# Altium schematic sheet Hardwiring.SchDoc
size 594 x 420 mm; Address1: Address1; Address2: Address2; Address3: Address3; Address4: Address4; DocumentNumber: *Э3; SheetNumber: 10; SheetTotal: 11; DocumentType: Схема электрическая *
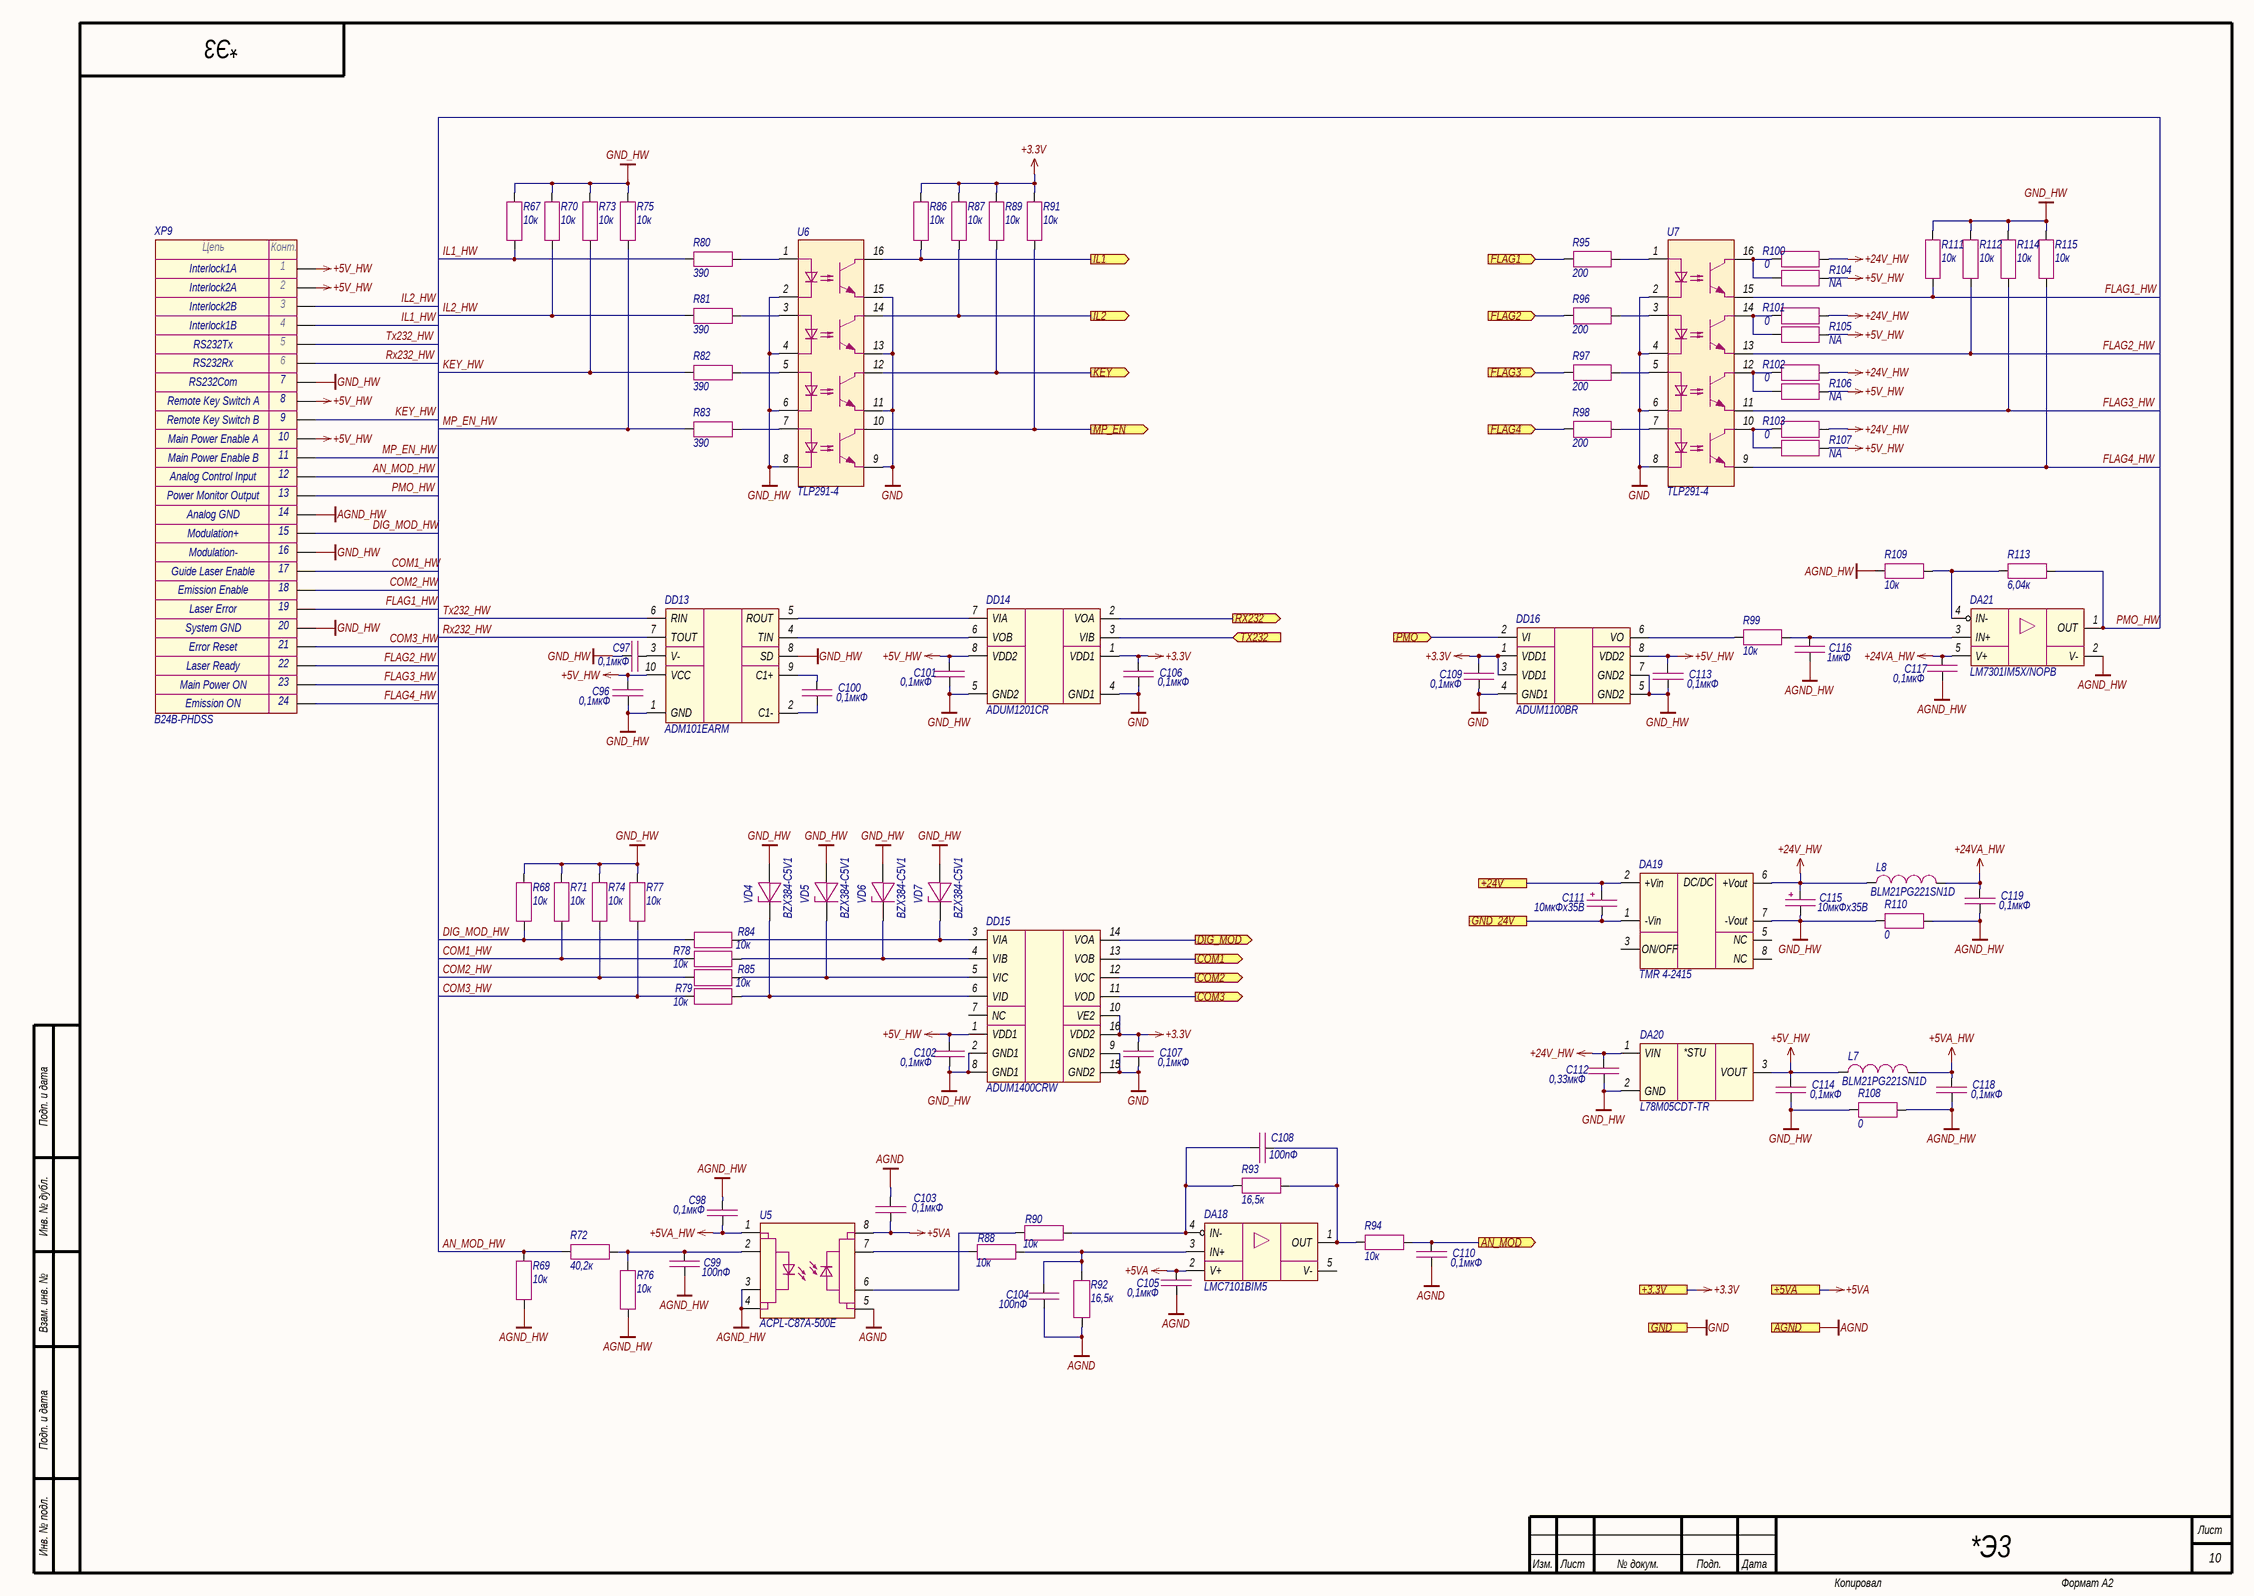
[diagram p0: Hardwiring.SchDoc]

## Parts
C96  0,1мкФ  [CAP_0603]
C97  0,1мкФ  [CAP_0603]
C98  0,1мкФ  [CAP_0603]
C99  100пФ  [CAP_0603]
C100  0,1мкФ  [CAP_0603]
C101  0,1мкФ  [CAP_0603]
C102  0,1мкФ  [CAP_0603]
C103  0,1мкФ  [CAP_0603]
C104  100пФ  [CAP_0603]
C105  0,1мкФ  [CAP_0603]
C106  0,1мкФ  [CAP_0603]
C107  0,1мкФ  [CAP_0603]
C108  100пФ  [CAP_0603]
C109  0,1мкФ  [CAP_0603]
C110  0,1мкФ  [CAP_0603]
C111  10мкФх35B  [CAP_C]
C112  0,33мкФ  [CAP_0805]
C113  0,1мкФ  [CAP_0603]
C114  0,1мкФ  [CAP_0603]
C115  10мкФх35B  [CAP_C]
C116  1мкФ  [CAP_0603]
C117  0,1мкФ  [CAP_0603]
C118  0,1мкФ  [CAP_0603]
C119  0,1мкФ  [CAP_0603]
DA18  LMC7101BIM5  [SOT-23-5]
DA19  TMR 4-2415  [TMR4 (SIP-8)]
DA20  L78M05CDT-TR  [TO-252]
DA21  LM7301IM5X/NOPB  [SOT-23-5]
DD13  ADM101EARM  [MSOP-10]
DD14  ADUM1201CR  [SOIC-8]
DD15  ADUM1400CRW  [SOIC-16W]
DD16  ADUM1100BR  [SOIC-8]
L7  BLM21PG221SN1D  [IND_0805]
L8  BLM21PG221SN1D  [IND_0805]
R67  10к  [RES_0603]
R68  10к  [RES_0603]
R69  10к  [RES_0603]
R70  10к  [RES_0603]
R71  10к  [RES_0603]
R72  40,2к  [RES_0603]
R73  10к  [RES_0603]
R74  10к  [RES_0603]
R75  10к  [RES_0603]
R76  10к  [RES_0603]
R77  10к  [RES_0603]
R78  10к  [RES_0603]
R79  10к  [RES_0603]
R80  390  [RES_0603]
R81  390  [RES_0603]
R82  390  [RES_0603]
R83  390  [RES_0603]
R84  10к  [RES_0603]
R85  10к  [RES_0603]
R86  10к  [RES_0603]
R87  10к  [RES_0603]
R88  10к  [RES_0603]
R89  10к  [RES_0603]
R90  10к  [RES_0603]
R91  10к  [RES_0603]
R92  16,5к  [RES_0603]
R93  16,5к  [RES_0603]
R94  10к  [RES_0603]
R95  200  [RES_0603]
R96  200  [RES_0603]
R97  200  [RES_0603]
R98  200  [RES_0603]
R99  10к  [RES_0603]
R100  0  [RES_0603]
R101  0  [RES_0603]
R102  0  [RES_0603]
R103  0  [RES_0603]
R104  NA  [RES_0603]
R105  NA  [RES_0603]
R106  NA  [RES_0603]
R107  NA  [RES_0603]
R108  0  [RES_0805]
R109  10к  [RES_0603]
R110  0  [RES_0805]
R111  10к  [RES_0603]
R112  10к  [RES_0603]
R113  6,04к  [RES_0603]
R114  10к  [RES_0603]
R115  10к  [RES_0603]
U5  ACPL-C87A-500E  [SSO-8]
U6  TLP291-4  [SOP-16]
U7  TLP291-4  [SOP-16]
VD4  BZX384-C5V1  [SOD-323]
VD5  BZX384-C5V1  [SOD-323]
VD6  BZX384-C5V1  [SOD-323]
VD7  BZX384-C5V1  [SOD-323]
XP9  B24B-PHDSS  [B24B-PHDSS]

## Ports
+3.3V (see Main[3B], Ethernet[3D], Fiber_interlock[2C], Flow_sensor[2C], LD_driver[1D], Power_supply[1D]), +5VA (see Main[3B], LD_driver[1D], Photodiode[1C]), +24V (see Main[3B], Flow_sensor[2C], Indication[1C], LD_driver[1D], Power_supply[1D]), AGND (see Main[3B], LD_driver[1D], Photodiode[1D], Thermistor[2C]), AN_MOD (out, see Main[2B]), COM1 (out, see Main[2B]), COM2 (out, see Main[2B]), COM3 (out, see Main[2B]), DIG_MOD (out, see Main[2B]), FLAG1 (in, see Main[3B]), FLAG2 (in, see Main[3B]), FLAG3 (in, see Main[3B]), FLAG4 (in, see Main[3B]), GND (see Main[3B], Ethernet[3D], Fiber_interlock[2C], Flow_sensor[2C], Guide_laser[1C], Indication[1C], LD_driver[1D], Power_supply[1D]), GND_24V (see Main[3B], Flow_sensor[2C], Indication[1C], LD_driver[1D], Power_supply[1D]), IL1 (out, see Main[2B]), IL2 (out, see Main[2B]), KEY (out, see Main[2B]), MP_EN (out, see Main[2B]), PMO (in, see Main[3B]), RX232 (out, see Main[2B]), TX232 (in, see Main[2B])

## Nets
+3.3V: C106.1 C107.1 C109.1 DD14.1(VDD1) DD15.10(VE2) DD15.16(VDD2) DD16.1(VDD1) DD16.3(VDD1) R86.1 R87.1 R89.1 R91.1 ; port +3.3V
+5V_HW: C96.1 C101.1 C102.1 C113.1 C114.1 DA20.3(VOUT) DD13.10(VCC) DD14.8(VDD2) DD15.1(VDD1) DD16.8(VDD2) L7.1 R104.2 R105.2 R106.2 R107.2 XP9.1 XP9.2 XP9.8 XP9.10
+5VA: C103.1 C105.1 DA18.2(V+) U5.8(VDD2) ; port +5VA
+5VA_HW: C98.1 C118.1 L7.2 U5.1(VDD1)
+24V_HW: C112.2 C115.1 DA19.6(+Vout) DA20.1(VIN) L8.1 R100.2 R101.2 R102.2 R103.2
+24VA_HW: C117.1 C119.1 DA21.5(V+) L8.2
AGND: C103.2 C104.2 C105.2 C110.2 R92.2 U5.5(GND2) ; port AGND
AGND_HW: C98.2 C99.1 C116.2 C117.2 C118.2 C119.2 DA21.2(V-) R69.2 R76.2 R108.2 R109.1 R110.2 U5.3(SHDN) U5.4(GND1) XP9.14
GND: C106.2 C107.2 C109.2 DD14.4(GND1) DD15.9(GND2) DD15.15(GND2) DD16.4(GND1) U6.9 U6.11 U6.13 U6.15 U7.2 U7.4 U7.6 U7.8 ; port GND
GND_HW: C96.2 C97.2 C101.2 C102.2 C112.1 C113.2 C114.2 C115.2 DA19.7(-Vout) DA20.2(GND) DD13.1(GND) DD13.8(SD) DD14.5(GND2) DD15.2(GND1) DD15.8(GND1) DD16.5(GND2) DD16.7(GND2) R67.1 R68.1 R70.1 R71.1 R73.1 R74.1 R75.1 R77.1 R108.1 R110.1 R111.1 R112.1 R114.1 R115.1 U6.2 U6.4 U6.6 U6.8 VD4.2(A) VD5.2(A) VD6.2(A) VD7.2(A) XP9.7 XP9.16 XP9.20
+24V: C111.1 DA19.2(+Vin) ; port +24V
AN_MOD: C110.1 R94.2 ; port AN_MOD
AN_MOD_HW: R69.1 R72.2 XP9.12
COM1: DD15.13(VOB) ; port COM1
COM1_HW: R71.2 R78.1 XP9.17
COM2: DD15.12(VOC) ; port COM2
COM2_HW: R74.2 R85.1 XP9.18
COM3: DD15.11(VOD) ; port COM3
COM3_HW: R77.2 R79.1 XP9.21
DIG_MOD: DD15.14(VOA) ; port DIG_MOD
DIG_MOD_HW: R68.2 R84.1 XP9.15
FLAG1: R95.2 ; port FLAG1
FLAG1_HW: R111.2 U7.15 XP9.19
FLAG2: R96.2 ; port FLAG2
FLAG2_HW: R112.2 U7.13 XP9.22
FLAG3: R97.2 ; port FLAG3
FLAG3_HW: R114.2 U7.11 XP9.23
FLAG4: R98.2 ; port FLAG4
FLAG4_HW: R115.2 U7.9 XP9.24
GND_24V: C111.2 DA19.1(-Vin) ; port GND_24V
IL1: R86.2 U6.16 ; port IL1
IL1_HW: R67.2 R80.1 XP9.4
IL2: R87.2 U6.14 ; port IL2
IL2_HW: R70.2 R81.1 XP9.3
KEY: R89.2 U6.12 ; port KEY
KEY_HW: R73.2 R82.1 XP9.9
MP_EN: R91.2 U6.10 ; port MP_EN
MP_EN_HW: R75.2 R83.1 XP9.11
PMO: DD16.2(VI) ; port PMO
PMO_HW: DA21.1(OUT) R113.2 XP9.13
RX232: DD14.2(VOA) ; port RX232
Rx232_HW: DD13.7(TOUT) XP9.6
TX232: DD14.3(VIB) ; port TX232
Tx232_HW: DD13.6(RIN) XP9.5
NetC97_1: C97.1 DD13.3(V-)
NetC99_2: C99.2 R72.1 R76.1 U5.2(VIN)
NetC100_1: C100.1 DD13.9(C1+)
NetC100_2: C100.2 DD13.2(C1-)
NetC104_1: C104.1 DA18.3(IN+) R88.2 R92.1
NetC108_1: C108.1 DA18.4(IN-) R90.2 R93.2
NetC108_2: C108.2 DA18.1(OUT) R93.1 R94.1
NetC116_1: C116.1 DA21.3(IN+) R99.2
NetDA21_4: DA21.4(IN-) R109.2 R113.1
NetDD13_4: DD13.4(TIN) DD14.6(VOB)
NetDD13_5: DD13.5(ROUT) DD14.7(VIA)
NetDD15_3: DD15.3(VIA) R84.2 VD7.1(K)
NetDD15_4: DD15.4(VIB) R78.2 VD6.1(K)
NetDD15_5: DD15.5(VIC) R85.2 VD5.1(K)
NetDD15_6: DD15.6(VID) R79.2 VD4.1(K)
NetDD16_6: DD16.6(VO) R99.1
NetR80_2: R80.2 U6.1
NetR81_2: R81.2 U6.3
NetR82_2: R82.2 U6.5
NetR83_2: R83.2 U6.7
NetR88_1: R88.1 U5.7(VOUT+)
NetR90_1: R90.1 U5.6(VOUT-)
NetR95_1: R95.1 U7.1
NetR96_1: R96.1 U7.3
NetR97_1: R97.1 U7.5
NetR98_1: R98.1 U7.7
NetR100_1: R100.1 R104.1 U7.16
NetR101_1: R101.1 R105.1 U7.14
NetR102_1: R102.1 R106.1 U7.12
NetR103_1: R103.1 R107.1 U7.10

Not connected (* = marked no-connect by the designer): DA18 5(V-); DA19 3(ON/OFF) 5(NC) 8(NC); DD15 7(NC)

## Notes on the sheet
- Interlock1A
- Interlock2A
- Interlock2B
- Interlock1B
- RS232Tx
- RS232Rx
- (near XP9) Remote Key Switch A
- RS232Com
- (near XP9) Remote Key Switch B
- (near XP9) Main Power Enable A
- (near XP9) Main Power Enable B
- (near XP9) Analog Control Input
- (near XP9) Power Monitor Output
- Analog GND
- Modulation+
- Modulation-
- (near XP9) Guide Laser Enable
- (near XP9) Emission Enable
- System GND
- Error Reset
- Laser Error
- Main Power ON
- Emission ON
- Laser Ready
- Подп. и дата
- Инв. № дубл.
- Взам. инв. №
- Инв. № подл.
- Изм.
- Лист
- № докум.
- Подп.
- Дата
- Копировал
- Формат А2
- (in symbol Connector-24) Цепь; Конт.
- (in symbol L78M) *STU
- (in symbol TMR4) DC/DC

## Library data of the parts
C96-C98 C100-C103 C105-C107 C109 C110 C113 C114 C117-C119 = Capacitor: Manufacturer: Murata; Model: GRM188R71H104KA93D; Value: 0,1мкФ; Document: *
C99 C104 C108 = Capacitor: Manufacturer: Murata; Model: GRM1885C1H101JA01D; Value: 100пФ; Document: *
C111 C115 = Capacitor_Polar: Model: TECAP, 10 мкФ, 35 В, тип C, 10%; Value: 10мкФх35B; Document: *; Manufacturer: *
C112 = Capacitor: Manufacturer: Murata; Model: GRM219R71H334KA88D; Value: 0,33мкФ; Document: *
C116 = Capacitor: Manufacturer: Murata; Model: GRM188R61H105KAALD; Value: 1мкФ; Document: *
DA18 = LMC7101: Manufacturer: Texas Instruments; Model: LMC7101BIM5; Document: *
DA19 = TMR4: Manufacturer: Traco Power; Model: TMR 4-2415; Document: *
DA20 = L78M: Manufacturer: STMicroelectronics; Model: L78M05CDT-TR; Document: *
DA21 = LM7301IM5: Manufacturer: Texas Instruments; Model: LM7301IM5X/NOPB; Document: *
DD13 = ADM101EARM: Manufacturer: Analog Devices; Model: ADM101EARM; Document: *
DD14 = ADUM1201: Manufacturer: Analog Devices; Model: ADUM1201CR; Document: *
DD15 = ADUM1400: Manufacturer: Analog Devices; Model: ADUM1400CRW; Document: *
DD16 = ADUM1100: Manufacturer: Analog Devices; Model: ADUM1100BR; Document: *
L7 L8 = Inductor: Manufacturer: Murata; Value: *; Model: BLM21PG221SN1D; Document: *
R67-R71 R73-R79 R84-R91 R94 R99 R109 R111 R112 R114 R115 = Resistor: Manufacturer: Yageo; Model: RC0603FR-0710KL; Value: 10к; Document: *
R72 = Resistor: Manufacturer: Yageo; Model: RC0603FR-0740K2L; Value: 40,2к; Document: *
R80-R83 = Resistor: Manufacturer: Yageo; Model: RC0603FR-07390RL; Value: 390; Document: *
R92 R93 = Resistor: Manufacturer: Yageo; Model: RC0603FR-0716K5L; Value: 16,5к; Document: *
R95-R98 = Resistor: Manufacturer: Yageo; Model: RC0603FR-07200RL; Value: 200; Document: *
R100-R103 = Resistor: Manufacturer: Yageo; Model: RC0603FR-070RL; Value: 0; Document: *
R104-R107 = Resistor: Value: NA; Model: *; Document: *; Manufacturer: *
R108 R110 = Resistor: Manufacturer: Yageo; Model: RC0805FR-070RL; Value: 0; Document: *
R113 = Resistor: Manufacturer: Yageo; Model: RC0603FR-076K04L; Value: 6,04к; Document: *
U5 = ACPL-C87: Manufacturer: Broadcom; Model: ACPL-C87A-500E
U6 U7 = TLP281-4: Manufacturer: Toshiba; Model: TLP291-4; Document: *
VD4-VD7 = Diode_Zener: Manufacturer: Nexperia; Model: BZX384-C5V1; Document: *
XP9 = Connector-24: Manufacturer: JST; Model: B24B-PHDSS; Document: *